# Altium schematic sheet STM32.SchDoc: STM32
size A3; DocumentNumber: 11; Revision: 2.0; SheetNumber: 11; SheetTotal: 18
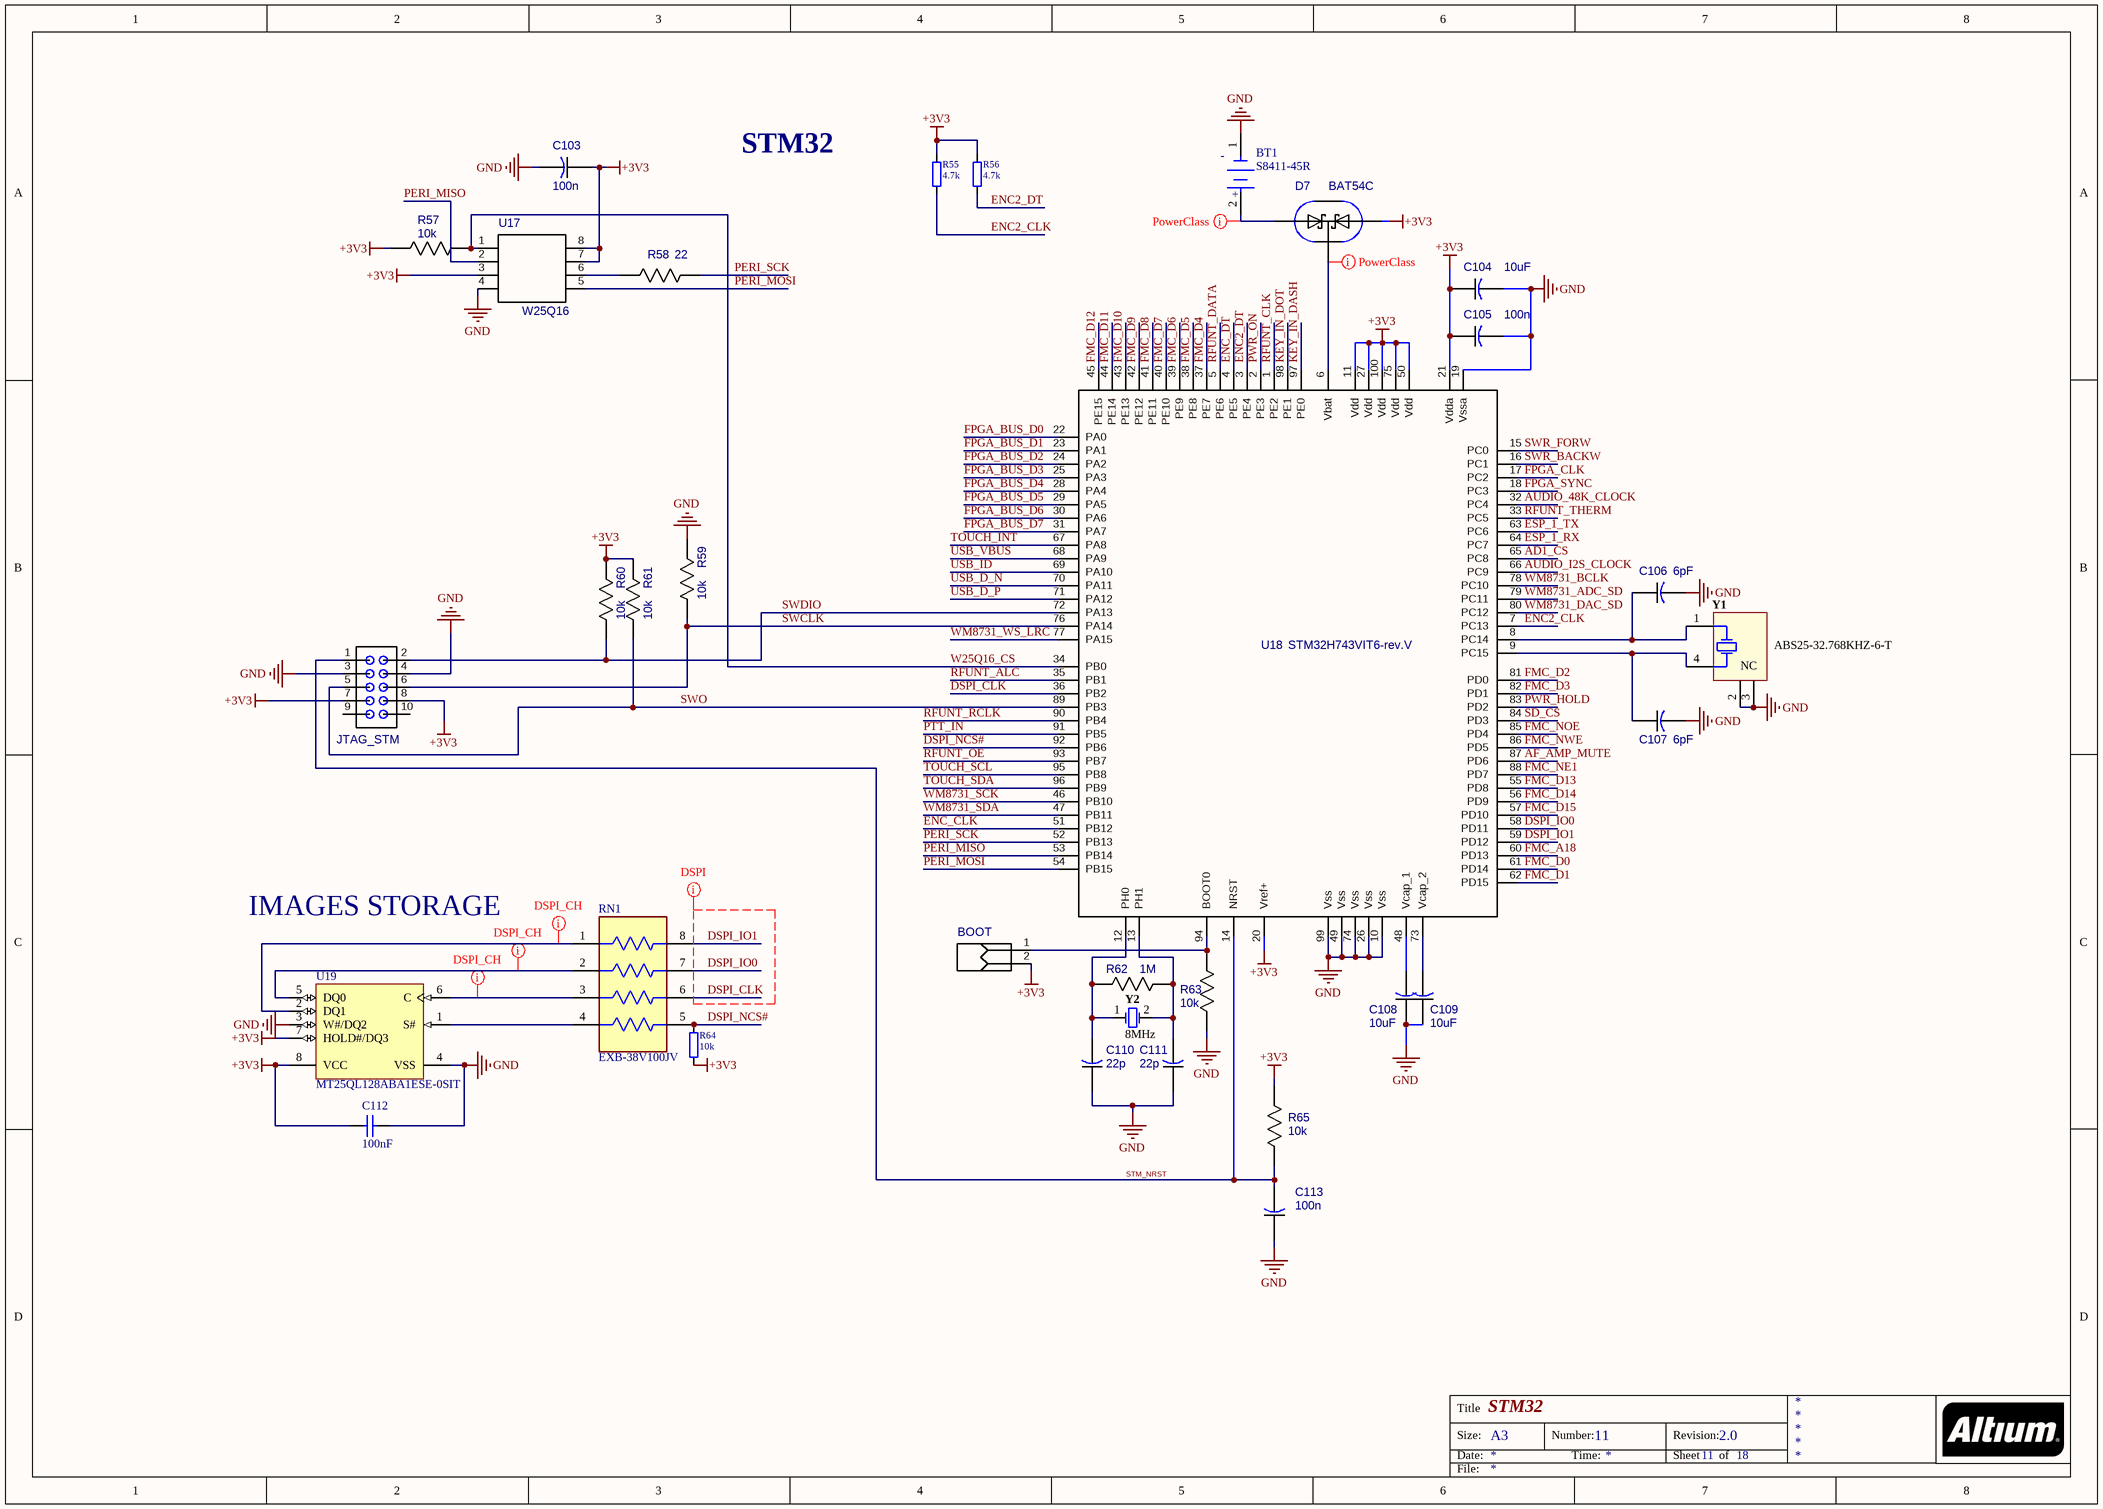
[diagram p0: STM32.SchDoc]

## Parts
BOOT  (no value)  [51022-0200]
BT1  S8411-45R  [FP-S8411-45R-MFG]
C103  100n  [CAP_0805]
C104  10uF  [CAP_0805]
C105  100n  [CAP_0805]
C106  6pF  [CAP_0805]
C107  6pF  [CAP_0805]
C108  10uF  [CAP_0805]
C109  10uF  [CAP_0805]
C110  22p  [CAP_0805]
C111  22p  [CAP_0805]
C112  100nF  [C-0805]
C113  100n  [CAP_0805]
D7  BAT54C  [BAT54C]
JTAG_STM  (no value)  [IDC10]
R55  4.7k  [R-0603]
R56  4.7k  [R-0603]
R57  10k  [RES_0805]
R58  22  [RES_0805]
R59  10k  [RES_0805]
R60  10k  [RES_0805]
R61  10k  [RES_0805]
R62  1m  [RES_0805]
R63  10k  [RES_0805]
R64  10k  [R-0603]
R65  10k  [RES_0805]
RN1  EXB-38V100JV  [FP-EXB38V-MFG]
U17  W25Q16  [W25Q16]
U18  STM32H743VIT6-rev.V  [STM32H743VIT6]
U19  MT25QL128ABA1ESE-0SIT  [MICT-SE-8_M]
Y1  ABS25-32.768KHZ-6-T  [ABRA-ABS25-4_V]
Y2  8MHz  [FOX-FOXSLF-2_V]

## Nets
+3V3: BOOT.2 C103.1 C104.1 C105.1 C112.1 D7.1((A1)) JTAG_STM.7 JTAG_STM.8 R55.2 R56.2 R57.1 R60.1 R61.1 R64.1 R65.2 U17.3(WP) U17.7(HOLD) U17.8(VCC) U18.11(Vdd) U18.20(Vref+) U18.21(Vdda) U18.27(Vdd) U18.50(Vdd) U18.75(Vdd) U18.100(Vdd) U19.7(HOLD#/DQ3) U19.8(VCC)
GND: BT1.1(C) C103.2 C104.2 C105.2 C106.2 C107.2 C108.1 C109.1 C110.1 C111.1 C112.2 C113.1 JTAG_STM.3 JTAG_STM.4 R59.1 R63.1 U17.4(GND) U18.10(Vss) U18.19(Vssa) U18.26(Vss) U18.49(Vss) U18.74(Vss) U18.99(Vss) U19.3(W#/DQ2) U19.4(VSS) Y1.2(NC) Y1.3(NC)
AD1_CS: U18.65(PC8)
AF_AMP_MUTE: U18.87(PD6)
AUDIO_48K_CLOCK: U18.32(PC4)
AUDIO_I2S_CLOCK: U18.66(PC9)
DSPI_CLK: RN1.6 U18.36(PB2)
DSPI_IO0: RN1.7 U18.58(PD11)
DSPI_IO1: RN1.8 U18.59(PD12)
DSPI_NCS#: R64.2 RN1.5 U18.92(PB6)
ENC2_CLK: R55.1 U18.7(PC13)
ENC2_DT: R56.1 U18.3(PE4)
ENC_CLK: U18.51(PB12)
ENC_DT: U18.4(PE5)
ESP_1_RX: U18.64(PC7)
ESP_1_TX: U18.63(PC6)
FMC_A18: U18.60(PD13)
FMC_D0: U18.61(PD14)
FMC_D1: U18.62(PD15)
FMC_D2: U18.81(PD0)
FMC_D3: U18.82(PD1)
FMC_D4: U18.37(PE7)
FMC_D5: U18.38(PE8)
FMC_D6: U18.39(PE9)
FMC_D7: U18.40(PE10)
FMC_D8: U18.41(PE11)
FMC_D9: U18.42(PE12)
FMC_D10: U18.43(PE13)
FMC_D11: U18.44(PE14)
FMC_D12: U18.45(PE15)
FMC_D13: U18.55(PD8)
FMC_D14: U18.56(PD9)
FMC_D15: U18.57(PD10)
FMC_NE1: U18.88(PD7)
FMC_NOE: U18.85(PD4)
FMC_NWE: U18.86(PD5)
FPGA_BUS_D0: U18.22(PA0)
FPGA_BUS_D1: U18.23(PA1)
FPGA_BUS_D2: U18.24(PA2)
FPGA_BUS_D3: U18.25(PA3)
FPGA_BUS_D4: U18.28(PA4)
FPGA_BUS_D5: U18.29(PA5)
FPGA_BUS_D6: U18.30(PA6)
FPGA_BUS_D7: U18.31(PA7)
FPGA_CLK: U18.17(PC2)
FPGA_SYNC: U18.18(PC3)
KEY_IN_DASH: U18.97(PE0)
KEY_IN_DOT: U18.98(PE1)
PERI_MISO: U17.2(SO) U18.53(PB14)
PERI_MOSI: U17.5(SI) U18.54(PB15)
PERI_SCK: R58.2 U18.52(PB13)
PTT_IN: U18.91(PB5)
PWR_HOLD: U18.83(PD2)
PWR_ON: U18.2(PE3)
RFUNT_ALC: U18.35(PB1)
RFUNT_CLK: U18.1(PE2)
RFUNT_DATA: U18.5(PE6)
RFUNT_OE: U18.93(PB7)
RFUNT_RCLK: U18.90(PB4)
RFUNT_THERM: U18.33(PC5)
SD_CS: U18.84(PD3)
STM_NRST: C113.2 JTAG_STM.1 R65.1 U18.14(NRST)
SWCLK: JTAG_STM.6 R59.2 U18.76(PA14)
SWDIO: JTAG_STM.2 R60.2 U18.72(PA13)
SWO: JTAG_STM.5 R61.2 U18.89(PB3)
SWR_BACKW: U18.16(PC1)
SWR_FORW: U18.15(PC0)
TOUCH_INT: U18.67(PA8)
TOUCH_SCL: U18.95(PB8)
TOUCH_SDA: U18.96(PB9)
USB_D_N: U18.70(PA11)
USB_D_P: U18.71(PA12)
USB_ID: U18.69(PA10)
USB_VBUS: U18.68(PA9)
W25Q16_CS: R57.2 U17.1(CS) U18.34(PB0)
WM8731_ADC_SD: U18.79(PC11)
WM8731_BCLK: U18.78(PC10)
WM8731_DAC_SD: U18.80(PC12)
WM8731_SCK: U18.46(PB10)
WM8731_SDA: U18.47(PB11)
WM8731_WS_LRC: U18.77(PA15)
NetBOOT_1: BOOT.1 R63.2 U18.94(BOOT0)
NetBT1_2: BT1.2(A) D7.2((A2))
NetC106_1: C106.1 U18.8(PC14) Y1.1(X1)
NetC107_1: C107.1 U18.9(PC15) Y1.4(X2)
NetC108_2: C108.2 U18.48(Vcap_1)
NetC109_2: C109.2 U18.73(Vcap_2)
NetC110_2: C110.2 R62.1 U18.12(PH0) Y2.1
NetC111_2: C111.2 R62.2 U18.13(PH1) Y2.2
NetD7_3: D7.3((K1),(K2)) U18.6(Vbat)
NetR58_1: R58.1 U17.6(CLK)
NetRN1_1: RN1.1 U19.2(DQ1)
NetRN1_2: RN1.2 U19.5(DQ0)
NetRN1_3: RN1.3 U19.6(C)
NetRN1_4: RN1.4 U19.1(S#)

Not connected (* = marked no-connect by the designer): JTAG_STM 9 10

## Layout directives
net class PowerPads: NetBT1_2, NetD7_3
rule Matched Net Lengths [Tolerance = 100mil]; net class DSPI: DSPI_CLK, DSPI_IO0, DSPI_IO1
rule Matched Net Lengths [Tolerance = 100mil]; net class DSPI_CH: NetRN1_1, NetRN1_2, NetRN1_3

## Notes on the sheet
- STM32
- IMAGES STORAGE
- Title
- Size:
- Date:
- A3
- Number:
- Time:
- Revision:
- Sheet
- of
- File:
- (in symbol CMP-15817-000007-1) -; +

## Library data of the parts
BOOT = 51022-0200: 2 Pin
BT1 = CMP-15817-000007-1: BATTERY HOLDER COIN 12MM SMD; Number of Batteries: 1; Material: Polyphenylene; Case/Package: SMD/SMT; Number of Cells: 1; Min Operating Temperature: -55°C; Termination: SMD/SMT; REACH SVHC: No SVHC; Contact Plating: Bronze; Package Quantity: 500; Max Operating Temperature: 105°C; Mount: Surface Mount; Packaging: Tape and Reel
C103-C111 C113 = CAP_0805
  C103 C105 C113: Value: 100n
  C104 C108 C109: Value: 10uF
  C110 C111: Value: 22p
C112 = C semi: Ceramic Multilayer Capacitor; Manufacturer: Yageo/Phycomp; Manufacturer P/N: CC0603JRNPO9BN102; numsch: 011; TypeNum: 155; Parameters: 1nF, NP0, 50V, ±5%; Tolerance: ±10%; Voltage: *
JTAG_STM = IDC10: 2*5 Pin
R55 R56 R64 = RES semi: Chip Resistor; Manufacturer: Yageo/Phycomp; Manufacturer P/N: RC0603FR-0749R9L; numsch: 021; TypeNum: 212; Parameters: 49.9R, RC, 0.1W, ±1%, TCR ±100ppm; Power: *; TCR: *; Series: *; Tolerance: *
R57-R63 R65 = RES_0805
  R57 R59-R61 R63 R65: Value: 10k
  R58: Value: 22
  R62: Value: 1M
RN1 = CMP-05421-000006-1: RES ARRAY 4 RES 10 OHM 1206; Voltage Rating (DC): 100V; Number of Elements: 4; Power Per Element: 62.5mW; Resistance Tolerance: 5%; Power Dissipation: 63mW; Circuit Type: Isolated; Number of Terminals/Pins: 8; Temperature Coefficient: 200ppm/°C; Resistance: 10R; Voltage Rating: 50V; Packaging: Tape and Reel; Terminal Pitch: 0.8mm; Depth: 1.6mm; Series: EXB; Max Operating Temperature: 125°C; Military Standard: Not; Number of Resistors: 4; RoHS Compliant: Yes; Case Code (Metric): 3216; Mount: Surface Mount; Height: 0.024inch; Lead Free: Lead Free; Width: 0.063inch; Contact Plating: Tin; Number of Pins: 8; Length: 3.2mm; Technology: THICK FILM; Case/Package: 1206; Package Quantity: 1; Min Operating Temperature: -55°C; Size Code: 0603; Termination: Convex; Radiation Hardening: No; Tolerance: 5%; Case Code (Imperial): 1206; Number of Contacts: 8
U18 = STM32H743VIT6: Value: STM32H743VIT6-rev.V
U19 = CMP-2000-07468-1: Micron Serial NOR Flash Memory, 2.7 to 3.6 V, 128 Mb, -40 to 85 degC, 8-Pin SOP2 (SE), RoHS, Tape and Reel; Mounting Technology: SurfaceMount; Package Reference: SE-8; Package Description: 8-Pin Small Outline Package, Body 5.285 x 5.285 mm, Pitch 1.27 mm; Manufacturer: Micron; Manufacturer URL: http://www.micron.com/; Datasheet URL: https://www.micron.com/~/media/documents/products/data-sheet/nor-flash/serial-nor/mt25q/die-rev-a/mt25q_qlhs_l_128_aba_0.pdf; Datasheet Version: Rev. I , 09/2016; RoHSCompliant: true
Y1 = CMP-2000-05036-1: Low Frequency Crystal, 32.768 KHz, 6 pF, +/- 20 ppm, -40 to 85 degC, 4-Pin SMD, RoHS, Tape and Reel; Manufacturer: Abracon; Tolerance: 20PPM; ESR: 50kOhms; Case Width: 3.8mm; Case Height: 2.5mm; Case Length: 8mm; Load Capacitance: 6pF; Operating Temperature Range: -40Cto+85C; Package Reference: ABS25; Factory Pack Quantity: 3000; Package Description: 4-Pin Surface Mount Device, Body 8 x 3.8 mm, Pitch 5.5 mm; Frequency: 32.768kHz; Termination Style: SMD/SMT; Manufacturer URL: http://www.abracon.com/; Type: LowFrequencyCrystal; Dimensions: 3.8mmWx8mmLx2.5mmH; Product Category: Crystals; Series: ABS25; RoHS: Details; Package / Case: 8mmx3.8mm; Datasheet Version: Jun-17; Brand: ABRACON; Datasheet URL: https://datasheet.ciiva.com/854/abs25-854528.pdf; Packaging: Reel; Mounting Style: SMD/SMT
Y2 = CMP-1749-00004-1: Resistance Weld Thru-Hole Crystal, 8 MHz, +/-30 ppm, -20 to 70 degC, 2-Pin THD, RoHS, Bulk; Elements: 1; Rds On Max: 115 mohm; Typical Rise Time: 90 ns; Max Power Dissipation: 2.5 W; Case\Package: TO-251-3; Input Capacitance: 350 pF; REACH SVHC: No SVHC; Length: 6.6 mm; ComponentLink1URL: http://www.foxonline.com/; PackageDescription: 2-Pin Through Hole Device, Body 11.35 x 4.65 mm, Pitch 4.88 mm; Radiation Hardening: No; Package Quantity: 70; Packaging: Rail/Tube; ComponentLink1Description: Manufacturer URL; Min Operating Temperature: -55 degC; Max Operating Temperature: 150 degC; RoHSCompliant: true; PackageReference: FOXSLF-2; DatasheetVersion: Mar-15; Pins: 3; Height: 6.1 mm; Mount: Through Hole; ComponentLink2URL: http://www.foxonline.com/pdfs/hc49slf.pdf; ComponentLink2Description: Datasheet; Width: 2.3 mm
D7 = BAT54C: Value: BAT54C
U17 = W25Q16: Value: W25Q16